# EAGLE design ospi_v14+ (EAGLE 7.1.0)
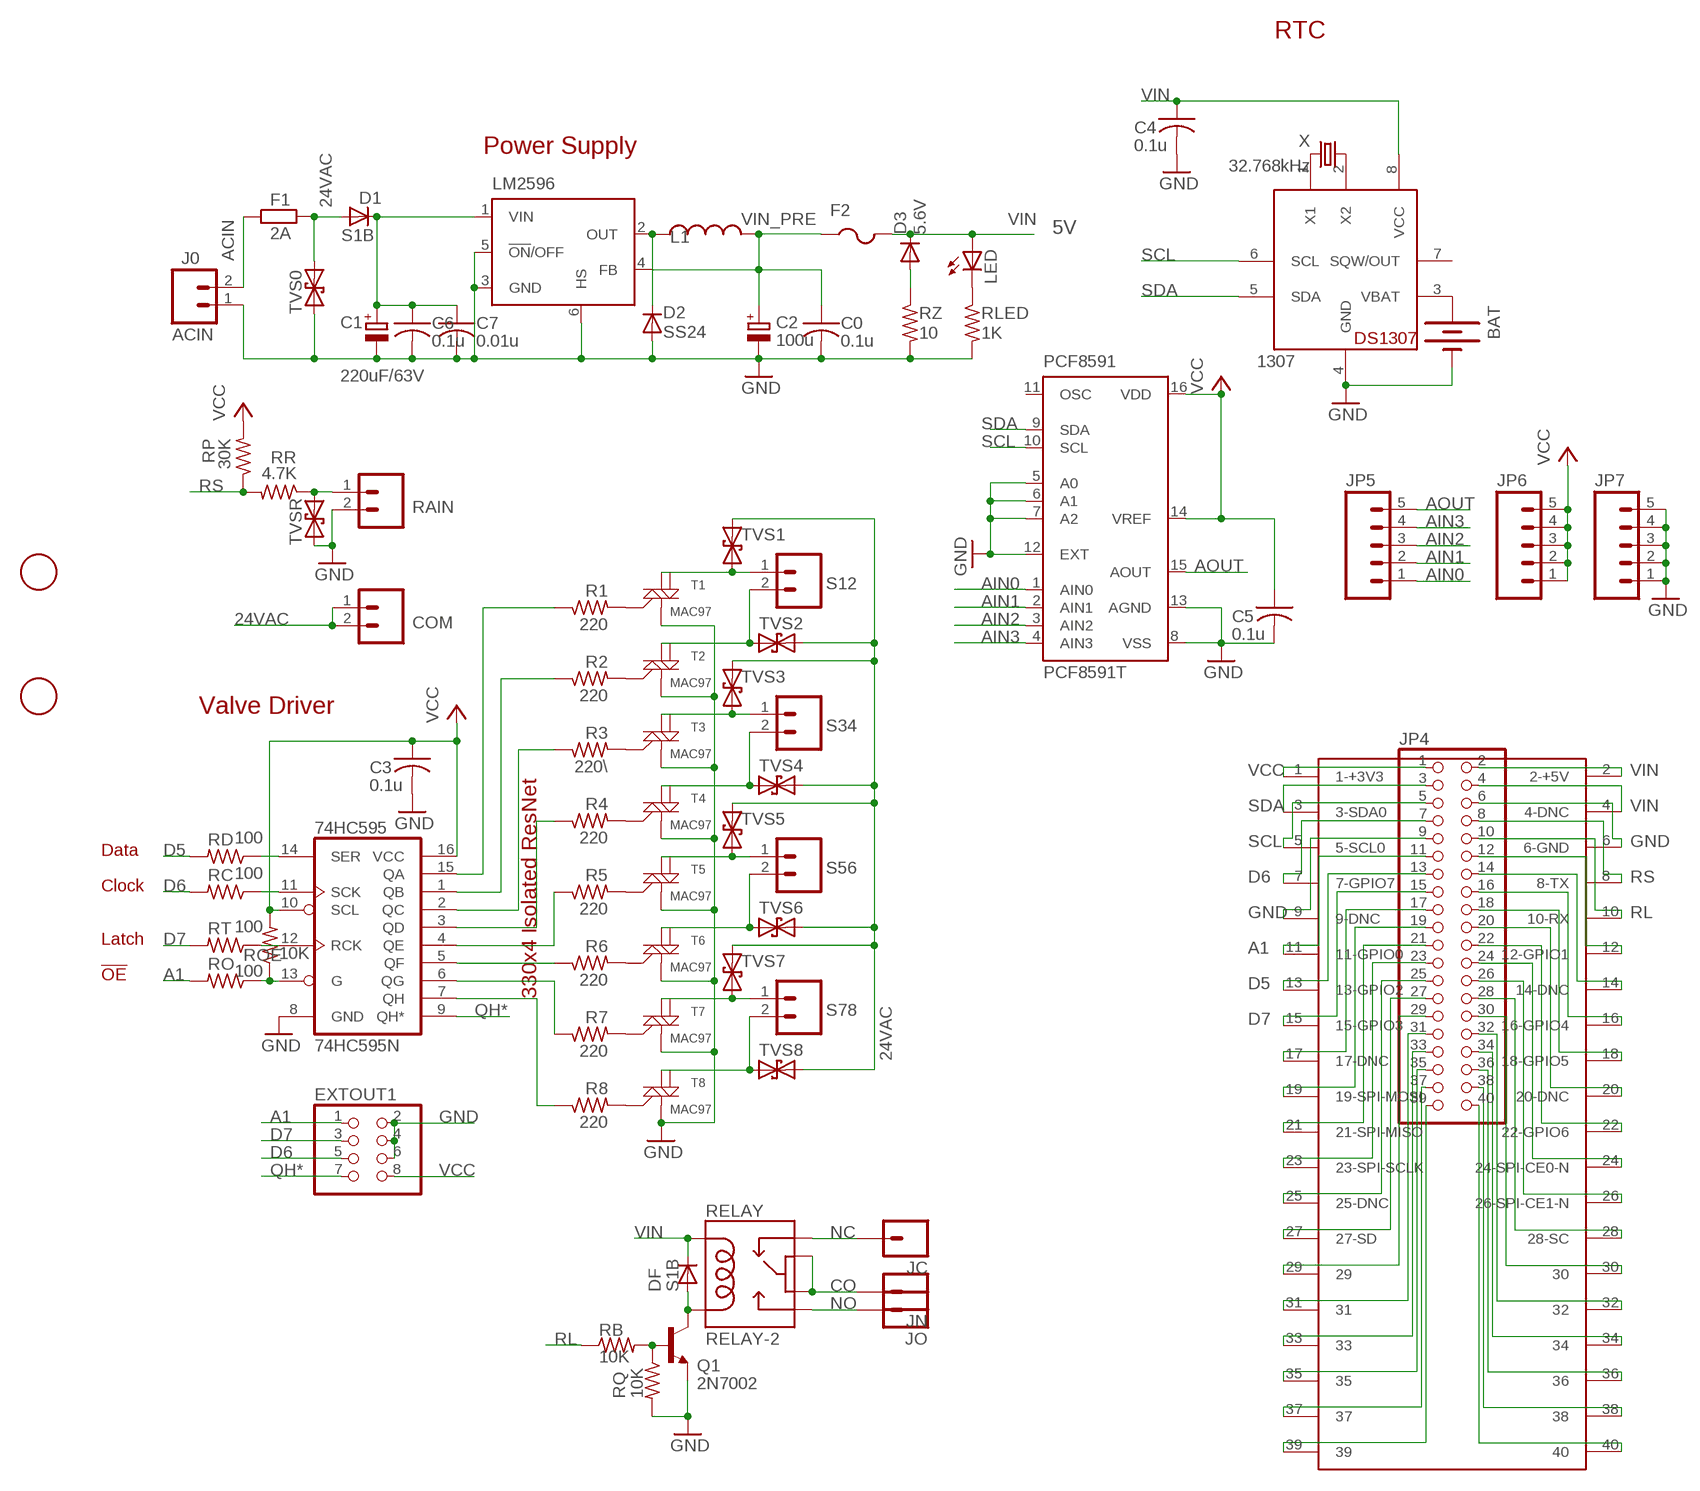
[diagram p0: schematic, sheet 1]

## Parts
74HC595  74HC595N  74LS595D  [SO16]
1307  DS1307  DS1307SOIC  [SO08]
BAT  BATTERYBATTERY_12MM_SMT  [BATTCON_12MM_SMT]
C0  0.1u  C-USC0805K  [C0805K]
C1  220uF/63V  CPOL-EUE3.5-8  [E3,5-8]
C2  100u  CPOL-EUE3.5-8  [E3,5-8]
C3  0.1u  C-USC0805K  [C0805K]
C4  0.1u  C-USC0805K  [C0805K]
C5  0.1u  C-USC0805K  [C0805K]
C6  0.1u  C-USC0805K  [C0805K]
C7  0.01u  C-USC0805K  [C0805K]
COM  M025MM-X  [SCREWTERMINAL-5MM-2-X]
D1  S1B  DIODE-DO-214AC  [DO-214AC]
D2  SS24  DIODE-SMB  [SMB]
D3  5.6V  DIODE-MINIMELF  [MINIMELF]
DF  S1B  DIODE-DO-214AC  [DO-214AC]
EXTOUT1  PINHD-2X4/90  [2X04/90]
F1  2A  R-EU_0414/5V  [0414V]
F2  PTCFUSE-1812  [1812]
J0  ACIN  M024MM-X  [SCREWTERMINAL-4MM-2-X]
JC  M01PTH  [1X01]
JN  M01PTH  [1X01]
JO  M01PTH  [1X01]
JP4  PINHD-2X20  [2X20]
JP5  M05PTH  [1X05]
JP6  M05PTH  [1X05]
JP7  M05PTH  [1X05]
L1  150uH  L-US0207/7  [0207/7]
LED  LEDCHIPLED_0805  [CHIPLED_0805]
LM2596  LM2596S  [TO263-5]
PCF8591  PCF8591T  [SO16W]
Q1  2N7002  TRANSISTOR_NPNSOT23-3  [SOT23-3]
R1  220  R-US_R0805  [R0805]
R2  220  R-US_R0805  [R0805]
R3  220\  R-US_R0805  [R0805]
R4  220  R-US_R0805  [R0805]
R5  220  R-US_R0805  [R0805]
R6  220  R-US_R0805  [R0805]
R7  220  R-US_R0805  [R0805]
R8  220  R-US_R0805  [R0805]
RAIN  M025MM-X  [SCREWTERMINAL-5MM-2-X]
RB  10K  R-US_R0805  [R0805]
RC  100  R-US_R0805  [R0805]
RD  100  R-US_R0805  [R0805]
RELAY  RELAY-2  [RELAY-HK4100F]
RLED  1K  R-US_R0805  [R0805]
RO  100  R-US_R0805  [R0805]
ROE  10K  R-US_R0805  [R0805]
RP  30K  R-US_R0805  [R0805]
RQ  10K  R-US_R0805  [R0805]
RR  4.7K  R-US_R0805  [R0805]
RT  100  R-US_R0805  [R0805]
RZ  10  R-US_R0805  [R0805]
S12  M025MM-X  [SCREWTERMINAL-5MM-2-X]
S34  M025MM-X  [SCREWTERMINAL-5MM-2-X]
S56  M025MM-X  [SCREWTERMINAL-5MM-2-X]
S78  M025MM-X  [SCREWTERMINAL-5MM-2-X]
T1  MAC97  MAC97SOT223  [SOT223]
T2  MAC97  MAC97SOT223  [SOT223]
T3  MAC97  MAC97SOT223  [SOT223]
T4  MAC97  MAC97SOT223  [SOT223]
T5  MAC97  MAC97SOT223  [SOT223]
T6  MAC97  MAC97SOT223  [SOT223]
T7  MAC97  MAC97SOT223  [SOT223]
T8  MAC97  MAC97SOT223  [SOT223]
TVS0  TVSSMB  [SMB]
TVS1  TVSSMB  [SMB]
TVS2  TVSSMB  [SMB]
TVS3  TVSSMB  [SMB]
TVS4  TVSSMB  [SMB]
TVS5  TVSSMB  [SMB]
TVS6  TVSSMB  [SMB]
TVS7  TVSSMB  [SMB]
TVS8  TVSSMB  [SMB]
TVSR  TVSSMB  [SMB]
U$1  FIDUCIAL  [FIDUCIAL_1MM]
U$2  RPIB+  [RPIB+]
U$3  FIDUCIAL  [FIDUCIAL_1MM]
X  32.768kHz  CRYSTALTC38H  [TC38H]

## Nets
24VAC [power]: COM.1 COM.2 D1.A F1.2 TVS0.C TVS1.C TVS2.C TVS3.C TVS4.C TVS5.C TVS6.C TVS7.C TVS8.C
A1: EXTOUT1.1 JP4.11 RO.2 U$2.11(11-GPIO0)
ACIN [power]: F1.1 J0.2
AIN0: JP5.1 PCF8591.1(AIN0)
AIN1: JP5.2 PCF8591.2(AIN1)
AIN2: JP5.3 PCF8591.3(AIN2)
AIN3: JP5.4 PCF8591.4(AIN3)
AOUT: JP5.5 PCF8591.15(AOUT)
CO [relay power]: JN.1 RELAY.5 RELAY.6
D5: JP4.13 RD.2 U$2.13(13-GPIO2)
D6: EXTOUT1.5 JP4.7 RC.2 U$2.7(7-GPIO7)
D7: EXTOUT1.3 JP4.15 RT.2 U$2.15(15-GPIO3)
GND [power]: 74HC595.8(GND) 1307.4(GND) BAT.P$1(-) C0.2 C1.- C2.- C3.2 C4.2 C5.2 C6.2 C7.2 D2.A EXTOUT1.2 EXTOUT1.4 EXTOUT1.6 J0.1 JP4.6 JP4.9 JP7.1 JP7.2 JP7.3 JP7.4 JP7.5 LM2596.3(GND) LM2596.5(!ON!/OFF) LM2596.6(HS) PCF8591.5(A0) PCF8591.6(A1) PCF8591.7(A2) PCF8591.8(VSS) PCF8591.12(EXT) PCF8591.13(AGND) Q1.2(E) RAIN.2 RLED.2 RQ.2 RZ.2 T1.1(M1) T2.1(M1) T3.1(M1) T4.1(M1) T5.1(M1) T6.1(M1) T7.1(M1) T8.1(M1) TVS0.A TVSR.A U$2.6(6-GND) U$2.9(9-DNC)
N$1: LED.C RLED.1
N$2 [power]: C1.+ C6.1 C7.1 D1.C LM2596.1(VIN)
N$3: R1.2 T1.3(G)
N$4: 74HC595.5(QF) R6.1
N$5: 74HC595.6(QG) R7.1
N$6: D3.A RZ.1
N$7: 74HC595.7(QH) R8.1
N$8 [power]: D2.C L1.1 LM2596.2(OUT)
N$9: 1307.1(X1) X.2
N$10: 74HC595.4(QE) R5.1
N$11: 74HC595.3(QD) R4.1
N$12: 74HC595.2(QC) R3.1
N$13: 74HC595.1(QB) R2.1
N$14: 74HC595.15(QA) R1.1
N$15: R2.2 T2.3(G)
N$16 [power]: S12.1 T1.2(M2) TVS1.A
N$17 [power]: S12.2 T2.2(M2) TVS2.A
N$18 [power]: S34.1 T3.2(M2) TVS3.A
N$19: R3.2 T3.3(G)
N$20 [power]: S34.2 T4.2(M2) TVS4.A
N$21: R4.2 T4.3(G)
N$22 [power]: S56.1 T5.2(M2) TVS5.A
N$23 [power]: S56.2 T6.2(M2) TVS6.A
N$24 [power]: S78.1 T7.2(M2) TVS7.A
N$25 [power]: S78.2 T8.2(M2) TVS8.A
N$26: R5.2 T5.3(G)
N$27: R6.2 T6.3(G)
N$28: R7.2 T7.3(G)
N$29: R8.2 T8.3(G)
N$30: 1307.2(X2) X.1
N$31: RAIN.1 RR.1 TVSR.C
N$32: Q1.1(B) RB.2 RQ.1
N$33: 74HC595.14(SER) RD.1
N$34: 74HC595.11(SCK) RC.1
N$35: 74HC595.12(RCK) RT.1
N$36: 1307.3(VBAT) BAT.P$2(+)
N$37: JP4.12 U$2.12(12-GPIO1)
N$38: JP4.14 U$2.14(14-DNC)
N$39: JP4.16 U$2.16(16-GPIO4)
N$40: 74HC595.13(G) RO.1 ROE.1
N$41: JP4.23 U$2.23(23-SPI-SCLK)
N$42: JP4.25 U$2.25(25-DNC)
N$43: JP4.27 U$2.27(27-SD)
N$44: JP4.29 U$2.29
N$45: JP4.39 U$2.39
N$46: JP4.37 U$2.37
N$47: JP4.17 U$2.17(17-DNC)
N$48: JP4.19 U$2.19(19-SPI-MOSI)
N$49: JP4.21 U$2.21(21-SPI-MISO)
N$50: JP4.35 U$2.35
N$51: JP4.33 U$2.33
N$52: JP4.31 U$2.31
N$53: JP4.34 U$2.34
N$54: JP4.36 U$2.36
N$55: JP4.38 U$2.38
N$56: JP4.40 U$2.40
N$59: JP4.18 U$2.18(18-GPIO5)
N$60: JP4.20 U$2.20(20-DNC)
N$61: JP4.22 U$2.22(22-GPIO6)
N$62: JP4.24 U$2.24(24-SPI-CE0-N)
N$63: JP4.26 U$2.26(26-SPI-CE1-N)
N$64: JP4.28 U$2.28(28-SC)
N$65: JP4.30 U$2.30
N$66: JP4.32 U$2.32
N$77 [power]: DF.A Q1.3(C) RELAY.9
NC [relay power]: JC.1 RELAY.1
NO [relay power]: JO.1 RELAY.10
QH*: 74HC595.9(QH*) EXTOUT1.7
RL: JP4.10 RB.1 U$2.10(10-RX)
RS: JP4.8 RP.1 RR.2 U$2.8(8-TX)
SCL: 1307.6(SCL) JP4.5 PCF8591.10(SCL) U$2.5(5-SCL0)
SDA: 1307.5(SDA) JP4.3 PCF8591.9(SDA) U$2.3(3-SDA0)
VCC: 74HC595.10(SCL) 74HC595.16(VCC) C3.1 C5.1 EXTOUT1.8 JP4.1 JP6.1 JP6.2 JP6.3 JP6.4 JP6.5 PCF8591.14(VREF) PCF8591.16(VDD) ROE.2 RP.2 U$2.1(1-+3V3)
VIN [power]: 1307.8(VCC) C4.1 D3.C DF.C F2.2 JP4.2 JP4.4 LED.A RELAY.2 U$2.2(2-+5V) U$2.4(4-DNC)
VIN_PRE [power]: C0.1 C2.+ F2.1 L1.2 LM2596.4(FB)
Unconnected: 1307.7(SQW/OUT) PCF8591.11(OSC) T1.4(M2-4) T2.4(M2-4) T3.4(M2-4) T4.4(M2-4) T5.4(M2-4) T6.4(M2-4) T7.4(M2-4) T8.4(M2-4)

## Notes on the sheet
- RTC
- Power Supply
- 5V
- Valve Driver
- Data
- Clock
- Latch
- !OE
- 330x4 Isolated ResNet

## Library data of the parts
74HC595 = SparkFun:74*595: 8-bit SHIFT REGISTER, output latch
1307 = adafruit:DS1307: DS1307 Real time clock (RTC) with battery backup ability. Talk to it via i2c
BAT = SparkFunNew:BATTERY: Battery Holders Various common sizes : AA, AAA, 20mm coin cell and 12mm coin cell.
C0 C3-C7 = adafruit:C-US: CAPACITOR, American symbol
C1 C2 = resistor:CPOL-EU: POLARIZED CAPACITOR, European symbol
COM J0 RAIN S12 S34 S56 S78 = SparkFun:M02: Header 2 Standard 2-pin 0.1" header. Use with straight break away headers (SKU : PRT-00116), right angle break away headers (PRT-00553), swiss pins (PRT-00743), machine pins (PRT-00117), and female headers (PRT-00115). Molex polarized connector foot print use with SKU : PRT-08233 with associated crimp pins and housings.
D1-D3 DF = diode:DIODE-: DIODE
EXTOUT1 = pinhead:PINHD-2X4: PIN HEADER
F1 = rcl:R-EU_: RESISTOR, European symbol
F2 = adafruit:PTCFUSE: PTC fuses, resettable thermistors
JC JN JO = SparkFun:M01: Header 1 Standard 1-pin 0.1" header. Use with straight break away headers (SKU : PRT-00116), right angle break away headers (PRT-00553), swiss pins (PRT-00743), machine pins (PRT-00117), and female headers (PRT-00115).
JP4 = adafruit_3:PINHD-2X20: PIN HEADER
JP5-JP7 = SparkFun:M05: Header 5 Standard 5-pin 0.1" header. Use with straight break away headers (SKU : PRT-00116), right angle break away headers (PRT-00553), swiss pins (PRT-00743), machine pins (PRT-00117), and female headers (PRT-00115). Molex polarized connector foot print use with SKU : PRT-08230 with associated crimp pins and housings.
L1 = rcl:L-US: INDUCTOR, American symbol
LED = adafruit:LED: LED OSRAM: - CHIPLED LG R971, LG N971, LY N971, LG Q971, LY Q971, LO R971, LY R971 LH N974, LH R974 LS Q976, LO Q976, LY Q976 LO Q996 - Hyper CHIPLED LW Q18S LB Q993, LB Q99A, LB R99A - SideLED LS A670, LO A670, LY A670, LG A670, LP A670 LB A673, LV A673, LT A673, LW A673 LH A674 LY A675 LS A676, LA A676, LO A676, LY A676, LW A676 LS A679, LY A679, LG A679 - Hyper Micro SIDELED® LS Y876, LA Y876, LO Y876, LY Y876 LT Y87S - SmartLED LW L88C, LW L88S LB L89C, LB L89S, LG L890 LS L89K, LO L89K, LY L89K LS L896, LA L896, LO L896, LY L896 - TOPLED LS T670, LO T670, LY T670, LG T670, LP T670 LSG T670, LSP T670, LSY T670, LOP T670, LYG T670 LG T671, LOG T671, LSG T671 LB T673, LV T673, LT T673, LW T673 LH T674 LS T676, LA T676, LO T676, LY T676, LB T676, LH T676, LSB T676, LW T676 LB T67C, LV T67C, LT T67C, LS T67K, LO T67K, LY T67K, LW E67C LS E67B, LA E67B, LO E67B, LY E67B, LB E67C, LV E67C, LT E67C LW T67C LS T679, LY T679, LG T679 LS T770, LO T770, LY T770, LG T770, LP T770 LB T773, LV T773, LT T773, LW T773 LH T774 LS E675, LA E675, LY E675, LS T675 LS T776, LA T776, LO T776, LY T776, LB T776 LHGB T686 LT T68C, LB T68C - Hyper Mini TOPLED® LB M676 - Mini TOPLED Santana® LG M470 LS M47K, LO M47K, LY M47K Source: http://www.osram.convergy.de/
LM2596 = national-semiconductor:LM2596: SIMPLE SWITCHER® Power Converter 150 kHz 3A Step-Down Voltage Regulator Source: http://www.national.com/ds/LM/LM2596.pdf; MF: NATIONAL SEMICONDUCTOR; MPN: LM2596S-ADJ/NOPB; OC_FARNELL: 9494367; OC_NEWARK: 41K3842
PCF8591 = micro-philips:PCF8591: I2C-Bus D/A CONVERTER; MPN: PCF8591T/2,512; OC_FARNELL: 1826767; OC_NEWARK: 70R6911
Q1 = SparkFunNew:TRANSISTOR_NPN: Transistor NPN BJT configuration in SOT23 package. MMBT2222 is the common NPN we use. Double check BCE configuration again layout.
R1-R8 RB RC RD RLED RO ROE RP RQ RR RT RZ = adafruit2013:R-US_: RESISTOR, American symbol
RELAY = SparkFunNew:RELAY-2
T1-T8 = SparkFun:MAC97: MAC97 Triac http://www.onsemi.com/pub_link/Collateral/MAC97-D.PDF
TVS0 TVS1-TVS8 TVSR = SparkFunNew:TVS
U$1 U$3 = adafruitGood:FIDUCIAL: For use by pick and place machines to calibrate the vision/machine, 1mm By microbuilder.eu
U$2 = RaspberryPi:RPIB+
X = crystal:CRYSTAL: CRYSTAL; OC_FARNELL: unknown; OC_NEWARK: unknown

## Net classes
0 default: width 0.178 mm, clearance 0.178 mm
1 power: width 0.406 mm, clearance 0.254 mm
2 relay power: width 0.508 mm, clearance 0.305 mm

## Board
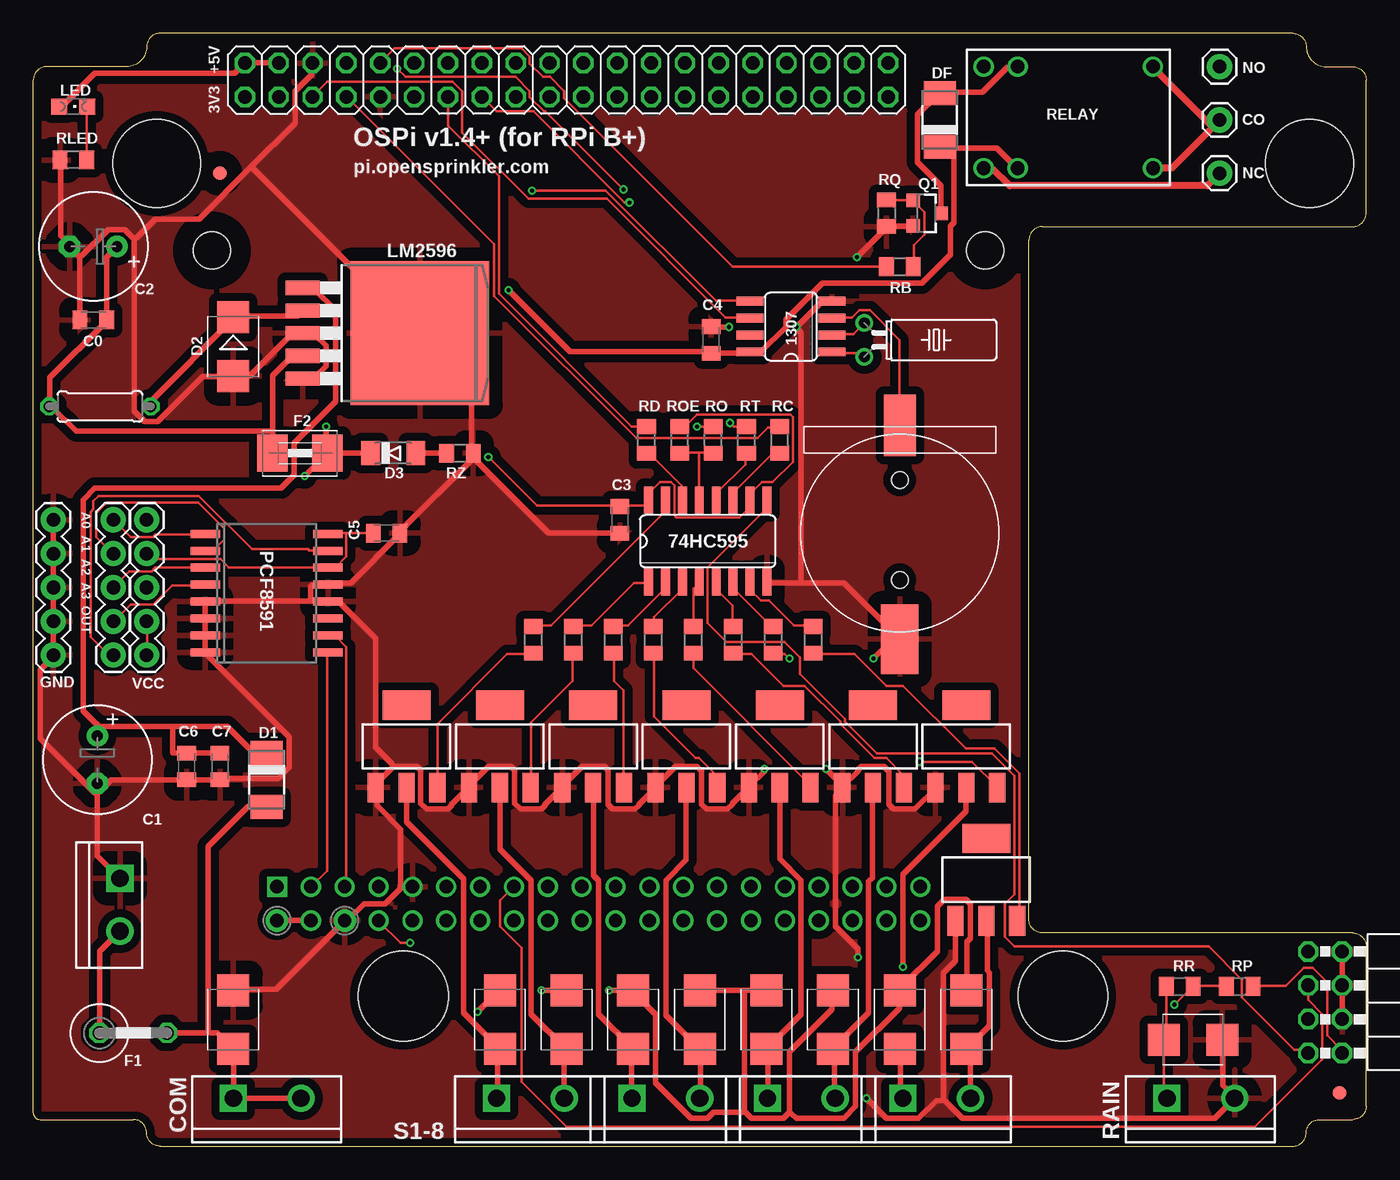
[diagram p1: board, top side]
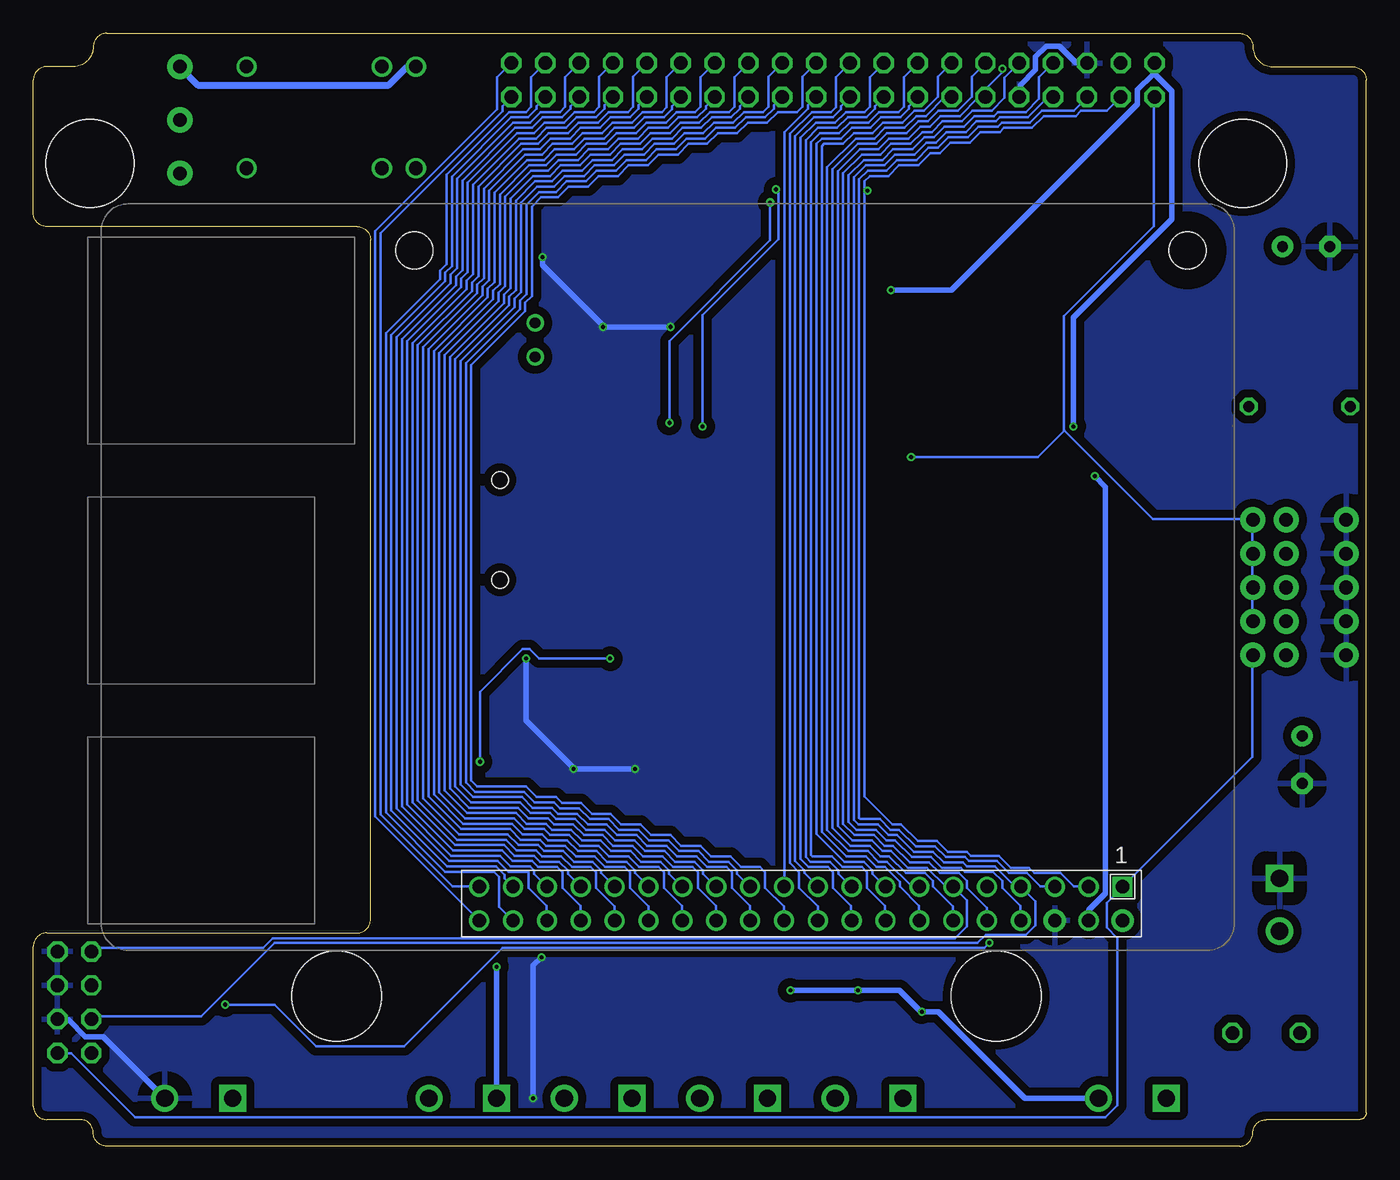
[diagram p2: board, bottom side, seen from below]

Size 100 x 83.5 mm. Coordinates in mm from the lower left corner, seen from the top.
Outline: 9.5,0 94.5,0 arc90 95.5,1 arc-90 96.5,2 99,2 arc90 100,3 100,15 arc90 99,16 75.7,16 arc-90 74.7,17 74.7,68 arc-90 75.7,69 99,69 arc90 100,70 100,80 arc90 99,81 97,81 arc-90 95.5,82.5 arc90 94.5,83.5 9.5,83.5 arc90 8.5,82.5 arc-90 7,81 1,81 arc90 0,80 0,2.5 arc90 0.5,2 7.5,2 arc-90 8.5,1 arc90 9.5,0
Copper layers (1*16): Top 0.035mm / dielectric 1.5mm / Bottom 0.035mm
Design rules "Fusion_eagle_rule_v1.1 *": minimum track width 6mil, minimum drill 12mil, track to track 6mil, track to pad 6mil, pad to pad 6mil, via to via 6mil, smd to smd 0mil, copper to edge 10mil, drill to drill 10mil, minimum pad ring 10mil, minimum via ring 6mil, stop-mask expansion 2mil, vias tented up to drill 100mil, thermal gap 40mil
Holes 6.6 mm at 9.26,73.74 95.74,73.74
Holes 6.75 mm at 27.76,11.26 77.24,11.26
tRestrict: area 69.1,64.9 to 73.7,69.5; area 11.1,64.9 to 15.7,69.5
bRestrict: area 11.1,64.9 to 15.7,69.5; area 69.1,64.9 to 73.7,69.5

### Footprints (pad centres in the part's own frame; a part is rotated, then mirrored left to right if it is on the bottom)
SO16 = smd 0.66 x 2.032: 1 -4.445,-3.073; 2 -3.175,-3.073; 3 -1.905,-3.073; 4 -0.635,-3.073; 5 0.635,-3.073; 6 1.905,-3.073; 7 3.175,-3.073; 8 4.445,-3.073; 9 4.445,3.073; 10 3.175,3.073; 11 1.905,3.073; 12 0.635,3.073; 13 -0.635,3.073; 14 -1.905,3.073; 15 -3.175,3.073; 16 -4.445,3.073
SO08 = smd 0.66 x 2.032: 1 -1.905,-3.073; 2 -0.635,-3.073; 3 0.635,-3.073; 4 1.905,-3.073; 5 1.905,3.073; 6 0.635,3.073; 7 -0.635,3.073; 8 -1.905,3.073
BATTCON_12MM_SMT = smd 2.8 x 5.2: P$1 0,11.96 | smd 2.4 x 4.6: P$2 0,-4.1 | hole 1.25: 0,7.5; 0,0
C0805K = smd 1.1 x 1.4: 1 -1,0; 2 1,0
E3,5-8 = drill 0.813 pad 1.6: + -1.778,0 | drill 0.813 pad 1.6 octagon: - 1.778,0
SCREWTERMINAL-5MM-2-X = drill 1.3 pad 2.032 square: 1 0,0 | drill 1.3 pad 2.032: 2 5.08,0
DO-214AC = smd 1.8 x 2.4: A 2.025,0; C -2.025,0
SMB = smd 2.4 x 2.4: A 2.2,0; C -2.2,0
MINIMELF = smd 1.4 x 1.8: A 1.7,0; C -1.7,0
2X04/90 = drill 1.016 octagon: 1 -3.81,-6.35; 2 -3.81,-3.81; 3 -1.27,-6.35; 4 -1.27,-3.81; 5 1.27,-6.35; 6 1.27,-3.81; 7 3.81,-6.35; 8 3.81,-3.81
0414V = drill 1.016 octagon: 1 -2.54,0; 2 2.54,0
1812 = smd 2.286 x 2.794: 1 -2.046,0; 2 2.046,0
SCREWTERMINAL-4MM-2-X = drill 1.3 pad 2.032 square: 1 0,0 | drill 1.3 pad 2.032: 2 3.96,0
1X01 = drill 1.016 pad 1.88: 1 0,0
2X20 = drill 1.016 octagon: 1 -24.13,-1.27; 2 -24.13,1.27; 3 -21.59,-1.27; 4 -21.59,1.27; 5 -19.05,-1.27; 6 -19.05,1.27; 7 -16.51,-1.27; 8 -16.51,1.27; 9 -13.97,-1.27; 10 -13.97,1.27; 11 -11.43,-1.27; 12 -11.43,1.27; 13 -8.89,-1.27; 14 -8.89,1.27; 15 -6.35,-1.27; 16 -6.35,1.27; 17 -3.81,-1.27; 18 -3.81,1.27; 19 -1.27,-1.27; 20 -1.27,1.27; 21 1.27,-1.27; 22 1.27,1.27; 23 3.81,-1.27; 24 3.81,1.27; 25 6.35,-1.27; 26 6.35,1.27; 27 8.89,-1.27; 28 8.89,1.27; 29 11.43,-1.27; 30 11.43,1.27; 31 13.97,-1.27; 32 13.97,1.27; 33 16.51,-1.27; 34 16.51,1.27; 35 19.05,-1.27; 36 19.05,1.27; 37 21.59,-1.27; 38 21.59,1.27; 39 24.13,-1.27; 40 24.13,1.27
1X05 = drill 1.016 pad 1.88: 1 0,0; 2 2.54,0; 3 5.08,0; 4 7.62,0; 5 10.16,0
0207/7 = drill 0.813 octagon: 1 -3.81,0; 2 3.81,0
CHIPLED_0805 = smd 1.2 x 1.2: A 0,-1.05; C 0,1.05
TO263-5 = smd 1.067 x 2.54: 1 -3.404,-5.791; 2 -1.702,-5.791; 3 0,-5.791; 4 1.702,-5.791; 5 3.404,-5.791 | smd 10.8 x 10.41: 6 0,3
SO16W = smd 0.6 x 2.2: 1 -4.445,-4.6; 2 -3.175,-4.6; 3 -1.905,-4.6; 4 -0.635,-4.6; 5 0.635,-4.6; 6 1.905,-4.6; 7 3.175,-4.6; 8 4.445,-4.6; 9 4.445,4.6; 10 3.175,4.6; 11 1.905,4.6; 12 0.635,4.6; 13 -0.635,4.6; 14 -1.905,4.6; 15 -3.175,4.6; 16 -4.445,4.6
SOT23-3 = smd 1 x 1: 1 -0.95,-1; 2 0.95,-1; 3 0,1.1
R0805 = smd 1.1 x 1.4: 1 -1,0; 2 1,0
RELAY-HK4100F = drill 1.016: 1 12.7,7.62; 2 10.16,7.62; 5 0,7.62; 6 0,0; 9 10.16,0; 10 12.7,0
SOT223 = smd 1.219 x 2.235: 1 -2.311,-3.099; 2 0,-3.099; 3 2.311,-3.099 | smd 3.6 x 2.2: 4 0,3.099
FIDUCIAL_1MM = smd 1 x 1: 1 0,0
RPIB+ = drill 1 square: 1 8.382,51.232 | drill 1 pad 1.676: 2 8.382,53.772; 6 13.462,53.772 | drill 1: 3 10.922,51.232; 4 10.922,53.772; 5 13.462,51.232; 7 16.002,51.232; 8 16.002,53.772; 9 18.542,51.232; 10 18.542,53.772; 11 21.082,51.232; 12 21.082,53.772; 13 23.622,51.232; 14 23.622,53.772; 15 26.162,51.232; 16 26.162,53.772; 17 28.702,51.232; 18 28.702,53.772; 19 31.242,51.232; 20 31.242,53.772; 21 33.782,51.232; 22 33.782,53.772; 23 36.322,51.232; 24 36.322,53.772; 25 38.862,51.232; 26 38.862,53.772; 27 41.402,51.232; 28 41.402,53.772; 29 43.942,51.232; 30 43.942,53.772; 31 46.482,51.232; 32 46.482,53.772; 33 49.022,51.232; 34 49.022,53.772; 35 51.562,51.232; 36 51.562,53.772; 37 54.102,51.232; 38 54.102,53.772; 39 56.642,51.232; 40 56.642,53.772 | hole 2.8: 3.5,3.5; 61.5,3.5
TC38H = drill 0.813: 1 -1.27,0; 2 1.27,0

### Placement (x,y rotation side)
74HC595  50.6,45.4 0 top
1307  56.85,61.5 90 top
BAT  65,50 180 top
C0  4.5,62 180 top
C1  4.8,29 270 top
C2  4.5,67.5 180 top
C3  44,47 270 top
C4  50.85,60.5 90 top
C5  26.5,46 0 top
C6  11.5,28.5 270 top
C7  14,28.5 270 top
COM  15,3.6 0 top
D1  17.5,27.5 270 top
D2  15,60 270 top
D3  27,52 0 top
DF  68,77 90 top
EXTOUT1  102,10.8 270 top
F1  7.5,8.5 0 top
F2  20,52 0 top
J0  6.5,20.1 270 top
JC  89,73 0 top
JN  89,77 0 top
JO  89,81 0 top
JP4  40,80 0 top
JP5  6,47 270 top
JP6  8.5,47 270 top
JP7  1.5,47 270 top
L1  5,55.5 180 top
LED  3,78 270 top
LM2596  26,61 270 top
PCF8591  17.5,41.5 270 top
Q1  67,70 270 top
R1  37.5,38 270 top
R2  40.5,38 270 top
R3  43.5,38 270 top
R4  46.5,38 270 top
R5  49.5,38 270 top
R6  52.5,38 270 top
R7  55.5,38 270 top
R8  58.5,38 270 top
RAIN  85.05,3.6 0 top
RB  65,66 0 top
RC  56,53 90 top
RD  46,53 90 top
RELAY  84,81 180 top
RLED  3,74 180 top
RO  51,53 90 top
ROE  48.5,53 90 top
RP  90.5,12 0 top
RQ  64,70 270 top
RR  86,12 0 top
RT  53.5,53 90 top
RZ  32,52 0 top
S12  34.76,3.6 0 top
S34  44.92,3.6 0 top
S56  55.08,3.6 0 top
S78  65.24,3.6 0 top
T1  28,30 0 top
T2  35,30 0 top
T3  42,30 0 top
T4  49,30 0 top
T5  56,30 0 top
T6  63,30 0 top
T7  70,30 0 top
T8  71.5,20 0 top
TVS0  15,9.5 90 top
TVS1  35,9.5 270 top
TVS2  40,9.5 270 top
TVS3  45,9.5 270 top
TVS4  50,9.5 270 top
TVS5  55,9.5 270 top
TVS6  60,9.5 270 top
TVS7  65,9.5 270 top
TVS8  70,9.5 270 top
TVSR  87,8 0 top
U$1  14,73 0 top
U$2  9.9,70.7 180 bottom
U$3  98,4 0 top
X  62.35,60.5 270 top

### Tracks (layer width: path | path; a pad name or v marks a point on that pad's centre or on a via)
24VAC  (via drill 0.3)
  Top 0.406: 53.34,11.69 54.94,11.69 TVS5.C | 53.34,11.69 50.05,11.69 TVS4.C | 56.72,2.53 56.72,7.07 59.92,10.27 59.92,11.69 TVS6.C | 56.72,2.53 56.27,2.09 53.87,2.09 53.34,2.62 | 53.34,11.69 53.34,2.62 | 56.72,2.53 56.9,2.44 57.25,2.09 60.81,2.09 61.7,2.98 61.7,7.07 64.99,10.36 64.99,11.69 TVS7.C 65.08,11.87 67.83,14.62 67.83,18 68.36,18.54 69.96,18.54 70.32,18.18 70.32,15.6 70.05,15.34 70.05,11.78 TVS8.C | v33.34,10.09 34.94,11.69 TVS1.C | v38.14,11.69 39.92,11.69 TVS2.C | v43.2,11.69 44.98,11.69 TVS3.C 45.07,11.51 46.67,9.91 46.67,4.76 49.34,2.09 50.58,2.09 51.03,2.53 53.16,2.53 53.34,2.62 | COM.2 20,3.6 15.2,3.6 COM.1 15.02,3.6 15.02,7.25 TVS0.C 14.85,7.42 13.78,8.49 13.1,8.49 | 13.1,8.49 F1.2 | 13.1,8.49 13.1,22.5 16.1,25.5 17.5,25.5 D1.A
  Bottom 0.406: COM.2 20.09,3.6 25.6,3.6 32.09,10.09 v33.34,10.09 33.52,10.18 35.03,11.69 v38.14,11.69 v43.2,11.69
A1  (via drill 0.3)
  Top 0.178: v49.78,54.01 50.94,54.01 RO.2 | v44.27,71.79 38.41,77.65 38.32,77.65 37.25,78.72 37.25,79.17 36.18,80.23 27.91,80.23 v27.29,80.85
  Bottom 0.178: v49.78,54.01 49.78,62.36 44.09,68.05 44.09,71.61 v44.27,71.79 | v27.29,80.85 27.29,80.59 28.54,79.34 28.54,78.81 JP4.11 28.6,78.7 29.1,78.7 30.5,77.3 31.95,77.3 32.75,76.5 33.45,76.5 34.35,75.6 35.8,75.6 36.6,74.8 38,74.8 39.65,73.15 39.65,24.05 38.55,22.95 37.1,22.95 36.3,22.15 35.65,22.15 34.4,20.9 32.95,20.9 31.55,19.5 31,19.5 U$2.11 30.94,19.42 29.96,18.45 29.96,16.49 30.85,15.6 82.06,15.6 82.77,14.89 95.57,14.89 EXTOUT1.1
ACIN
  Top 0.406: F1.1 4.98,8.58 4.98,14.62 J0.2
AIN0
  Top 0.178: PCF8591.1 12.89,45.89 9.16,45.89 8.98,45.72 7.29,45.72 6.04,46.96 JP5.1
AIN1
  Top 0.178: PCF8591.2 12.98,44.74 13.51,44.74 14.31,45.54 14.31,46.34 12.36,48.29 5.51,48.29 4.71,47.49 4.71,45.72 5.96,44.47 JP5.2
AIN2
  Top 0.178: PCF8591.3 9.16,43.4 8.89,43.14 7.2,43.14 6.04,41.98 JP5.3
AIN3
  Top 0.178: PCF8591.4 12.89,42.07 10.4,42.07 8.98,40.65 7.29,40.65 6.04,39.4 JP5.4
AOUT
  Top 0.178: PCF8591.15 22.1,44.7 20.7,44.7 20.6,44.8 16.4,44.8 12.4,48.8 4.9,48.8 4.5,48.4 4.5,47.8 4.3,47.6 4.3,38.2 5.6,36.9 6,36.9 JP5.5
CO
  Top 0.508: RELAY.5 85.43,73.39 88.99,76.94 JN.1 88.37,76.59 84.01,80.94 RELAY.6
D5
  Top 0.178: RD.2 45.96,54.01 44.9,54.01 34.94,63.96 34.94,72.76 31.11,76.59 JP4.13
  Bottom 0.178: U$2.13 33.55,19.5 34.1,19.5 35.95,21.35 36.6,21.35 37.4,22.15 38.85,22.15 40.45,23.75 40.45,73.45 38.3,75.6 36.9,75.6 36.1,76.4 34.65,76.4 33.75,77.3 33.05,77.3 31.65,78.7 31.15,78.7 JP4.13
D6
  Top 0.178: RC.2 55.92,53.92 55.12,53.92 54.32,53.12 45.25,53.12 34.58,63.78 34.58,67.7 23.56,78.72 JP4.7
  Bottom 0.178: JP4.7 23.5,78.7 23.9,78.7 25.4,77.2 27.5,77.2 27.8,76.9 29.25,76.9 30.05,76.1 31.5,76.1 32.3,75.3 33,75.3 33.9,74.4 35.35,74.4 36.15,73.6 37.55,73.6 38.45,72.7 38.45,24.5 38.1,24.15 36.65,24.15 35.85,23.35 35.2,23.35 33.95,22.1 32.5,22.1 31.7,21.3 30.25,21.3 29.95,21 27.85,21 26.35,19.5 25.95,19.5 U$2.7 25.87,19.42 24.8,18.36 24.8,16.58 25.51,15.87 28.54,15.87 29.16,15.25 81.88,15.25 87.39,9.73 95.57,9.73 EXTOUT1.5
D7  (via drill 0.3)
  Top 0.178: v52.27,54.27 52.54,54.01 53.43,54.01 RT.2 | v44.72,70.81 44.36,70.81 37.52,77.65 34.76,77.65 33.69,78.72 JP4.15 | EXTOUT1.3 95.66,12.05 95.66,10.98 96.72,9.91 96.72,6.53 91.66,1.47 40.01,1.47 36.63,4.85 36.63,14.89 35.03,16.49 35.03,18.45 36.01,19.42 U$2.15
  Bottom 0.178: U$2.15 36.1,19.5 37.05,20.45 37.05,20.7 37.7,21.35 39.15,21.35 41.25,23.45 41.25,75.2 40.85,75.6 39.4,75.6 38.6,76.4 37.2,76.4 36.4,77.2 34.95,77.2 34.3,77.85 34.3,78.05 33.65,78.7 JP4.15 | v52.27,54.27 52.27,60.41 44.72,67.96 v44.72,70.81
GND  (via drill 0.3)
  Top 0.406: LM2596.5 20.27,57.65 21.07,57.65 21.96,58.54 21.96,60.05 21.16,60.85 20.36,60.85 LM2596.3 20.18,60.94 19.38,60.94 16.27,57.83 15.02,57.83 D2.A 14.85,57.74 12.71,57.74 9.34,54.36 8.36,54.36 7.56,55.16 7.56,68.05 | 3.47,66.72 3.47,62.01 C0.2 | 3.47,66.72 2.76,67.43 C2.- 2.67,67.7 2.04,68.32 2.04,73.92 RLED.2 | 7.56,68.05 6.84,68.76 5.6,68.76 3.65,66.81 3.47,66.72 | 16.36,73.48 12.45,69.56 9.16,69.56 7.73,68.14 7.56,68.05 | 16.36,73.48 19.65,76.77 19.65,79.17 20.89,80.41 20.89,81.21 JP4.6 | 16.36,73.48 28.8,61.03 LM2596.6 29.07,60.85 32.89,57.03 32.89,52.14 RZ.2 | 57.61,42.27 60.81,42.27 64.99,38.09 BAT.P$1 64.63,38.18 v63.03,36.58 | 57.61,42.27 55.12,42.27 74HC595.8 | Q1.2 65.96,69.03 64.01,69.03 RQ.2 63.92,68.85 v61.78,66.72 | v52.18,61.47 50.85,61.47 C4.2 | 1307.4 59.92,63.34 59.12,63.34 v57.25,61.47 57.34,61.3 57.61,61.03 57.61,42.27 | 68.28,3.51 68.28,13.02 69.16,13.91 69.16,16.85 T8.1 | 68.28,3.51 69.7,2.09 88.63,2.09 90.06,3.51 RAIN.2 90.06,3.78 89.26,4.58 89.26,7.96 TVSR.A | JP7.1 1.51,46.96 1.51,44.65 JP7.2 1.51,44.38 1.51,42.07 JP7.3 1.51,41.89 1.51,39.58 JP7.4 1.51,39.31 1.51,36.91 JP7.5 1.4,36.65 0.5,35.75 0.5,30.6 4.6,26.5 C1.- | TVS0.A 15.02,11.78 18.22,11.78 23.29,16.85 U$2.6 23.56,16.94 24.8,18.18 26.4,18.18 27.65,19.42 | 27.65,19.42 28.36,19.42 U$2.9 | T6.1 60.72,26.98 61.87,28.14 61.87,28.23 62.14,28.49 63.83,28.49 64.19,28.14 64.19,25.65 64.54,25.29 66.14,25.29 67.74,26.89 T7.1 | 27.03,28.49 28.8,28.49 29.07,28.23 29.07,25.74 29.52,25.29 31.11,25.29 31.38,25.56 31.38,25.65 32.63,26.89 T2.1 32.72,27.07 34.14,28.49 35.83,28.49 36.09,28.23 36.09,25.74 36.54,25.29 38.14,25.29 38.41,25.56 38.41,25.65 39.65,26.89 T3.1 39.74,27.07 41.16,28.49 42.85,28.49 43.12,28.23 43.12,25.65 43.47,25.29 45.16,25.29 45.43,25.56 45.43,25.65 46.67,26.89 T4.1 46.76,27.07 48.18,28.49 49.78,28.49 50.14,28.14 50.14,25.65 50.49,25.29 52.09,25.29 52.45,25.65 52.45,25.74 53.61,26.89 T5.1 53.78,27.07 54.85,28.14 v54.85,28.31
  Top 0.406: 27.03,28.49 25.78,27.25 T1.1 25.78,26.71 25.78,25.56 27.56,23.78 27.56,19.6 27.65,19.42 | v59.47,28.31 60.63,27.16 T6.1 | v62.5,3.6 64.01,2.09 66.41,2.09 67.74,3.42 68.1,3.42 68.28,3.51 | v61.87,14.18 61.87,14.8 60.19,16.49 60.19,26.27 60.63,26.71 T6.1 | C1.- 4.8,21.8 J0.1 | C1.- 4.95,26.6 5.85,27.5 C6.2 C7.2 14.13,27.6 18.4,27.6 19.2,28.4 19.2,30.71 12.98,36.94 PCF8591.8 12.89,37.09 12.89,38.25 PCF8591.7 12.89,38.51 PCF8591.6 12.89,39.76 12.89,40.83 PCF8591.5 13.1,40.9 20.7,40.9 20.8,41 | 20.8,41 20.9,40.9 22.1,40.9 PCF8591.12 22.23,40.76 23.02,40.76 25.69,38.09 25.69,29.91 26.94,28.67 27.03,28.49 | 20.8,41 20.8,42 20.9,42.1 22.1,42.1 PCF8591.13 22.23,42.27 23.82,42.27 27.47,45.92 C5.2 27.56,46.18 32.98,51.61 32.98,51.96 RZ.2 | C3.2 43.92,46.01 38.67,46.01 33.16,51.52 RZ.2 | EXTOUT1.2 EXTOUT1.4 EXTOUT1.6
  Bottom 0.406: JP4.6 20.98,81.3 21.78,81.3 23.02,82.54 24,82.54 24.8,81.74 24.8,80.77 25.96,79.61 25.96,78.81 JP4.9 | v52.18,61.47 v57.25,61.47 57.34,61.65 61.78,66.1 v61.78,66.72 | v54.85,28.31 v59.47,28.31 59.56,28.49 63.03,31.96 v63.03,36.58 | v62.5,3.6 62.5,13.56 v61.87,14.18 | EXTOUT1.6 98.15,9.47 97.35,9.47 96.1,8.22 94.77,8.22 90.14,3.6 RAIN.2
  pour Top (isolate 0.61): 0,84 100,84 100,0 0,0
  pour Bottom (isolate 0.61): 0,84 100,84 100,0 0,0
N$1
  Top 0.178: LED.C 4,77.92 RLED.1
N$2
  Top 0.406: 10.45,31.5 14.55,31.5 16.5,29.55 17.5,29.55 D1.C | 10.45,31.5 4.8,31.5 | 10.45,31.5 10.45,29.55 10.5,29.5 C6.1 C7.1 | LM2596.1 20.27,64.32 21.07,64.32 22.67,62.72 22.67,55.87 19.56,52.76 19.56,50.36 18.58,49.38 4.62,49.38 3.73,48.49 3.73,32.67 4.71,31.69 4.8,31.69 4.8,31.5 | 4.8,31.5 C1.+
N$3
  Top 0.178: R1.2 37.43,36.94 35.56,36.94 30.32,31.69 30.32,26.98 T1.3
N$4
  Top 0.178: R6.1 52.45,39.07 52.45,40.58 51.3,41.74 51.3,42.27 74HC595.5
N$5
  Top 0.178: R7.1 55.47,39.07 55.3,39.07 52.54,41.83 52.54,42.27 74HC595.6
N$6
  Top 0.406: D3.A RZ.1
N$7
  Top 0.178: R8.1 58.5,39.07 57.07,39.07 55.21,40.94 54.59,40.94 53.78,41.74 53.78,42.27 74HC595.7
N$8
  Top 0.406: LM2596.2 20.18,62.63 19.82,62.27 15.02,62.27 D2.C 14.94,62.01 8.89,55.96 8.89,55.52 L1.1
N$9
  Top 0.178: 1307.1 60.01,59.52 62.05,59.52 62.32,59.25 X.2
N$10
  Top 0.178: R5.1 49.52,39.07 49.52,41.83 49.96,42.27 74HC595.4
N$11
  Top 0.178: R4.1 46.58,39.07 46.58,39.69 48.63,41.74 48.63,42.27 74HC595.3
N$12
  Top 0.178: R3.1 43.56,39.07 44.63,39.07 47.38,41.83 47.38,42.27 74HC595.2
N$13
  Top 0.178: R2.1 40.54,39.07 41.87,39.07 45.07,42.27 46.14,42.27 74HC595.1
N$14
  Top 0.178: R1.1 37.52,39.07 38.85,39.07 47.38,47.61 47.38,48.41 74HC595.15
N$15
  Top 0.178: R2.2 40.45,36.94 40.45,34.89 37.34,31.78 37.34,26.98 T2.3
N$16
  Top 0.406: T1.2 28,24.31 32.27,20.05 32.27,10 34.94,7.33 TVS1.A 34.85,7.16 34.85,3.6 S12.1
N$17
  Top 0.406: T2.2 35.03,26.89 35.03,22.27 37.34,19.96 37.34,9.91 39.92,7.33 TVS2.A 39.83,7.16 39.83,3.6 S12.2
N$18
  Top 0.406: T3.2 42.05,26.89 42.05,20.31 42.41,19.96 42.41,9.91 44.98,7.33 TVS3.A 44.9,7.16 44.9,3.6 S34.1
N$19
  Top 0.178: R3.2 43.56,36.94 43.56,34.89 44.27,34.18 44.27,26.98 T3.3
N$20
  Top 0.406: T4.2 48.98,26.89 48.98,21.47 47.47,19.96 47.47,9.82 49.96,7.33 TVS4.A 50.05,7.16 50.05,3.6 S34.2
N$21
  Top 0.178: R4.2 46.58,36.94 46.58,32.23 49.7,29.11 49.96,29.11 51.3,27.78 51.3,26.98 T4.3
N$22
  Top 0.406: T5.2 56.01,21.56 57.61,19.96 57.61,9.91 55.03,7.33 TVS5.A 55.12,7.16 55.12,3.6 S56.1
N$23
  Top 0.406: T6.2 62.94,26.89 62.94,20.14 62.67,19.87 62.67,10 60.01,7.33 TVS6.A 60.1,7.16 60.1,3.6 S56.2
N$24  (via drill 0.3)
  Top 0.406: v65.25,13.47 65.25,20.4 69.96,25.11 69.96,26.89 T7.2 | TVS7.A 65.08,7.25 65.08,3.69 65.16,3.6 S78.1
  Bottom 0.406: v65.25,13.47 65.25,3.6 S78.1
N$25
  Top 0.406: T8.2 71.56,16.85 71.56,13.2 71.74,13.02 71.74,9.02 70.05,7.33 TVS8.A 70.14,7.16 70.32,6.98 S78.2 | S78.2
N$26
  Top 0.178: R5.2 49.52,36.94 49.52,35.87 58.23,27.16 58.23,26.98 T5.3
N$27
  Top 0.178: R6.2 52.54,36.94 53.87,36.94 56.27,34.54 57.87,34.54 60.54,31.87 60.54,31.69 63.12,29.11 64.01,29.11 65.25,27.87 65.25,26.98 T6.3
N$28  (via drill 0.3)
  Top 0.178: v56.72,36.58 56.36,36.94 55.56,36.94 R7.2 | v66.5,28.85 70.41,28.85 72.28,26.98 T7.3
  Bottom 0.178: v56.72,36.58 62.05,36.58 62.76,37.29 63.3,37.29 66.5,34.09 v66.5,28.85
N$29
  Top 0.178: R8.2 58.59,36.94 61.61,36.94 64.01,34.54 65.25,34.54 69.96,29.83 72.1,29.83 73.97,27.96 73.97,17.02 73.88,16.94 T8.3
N$30
  Top 0.178: 1307.2 60.01,60.94 61.52,60.94 62.32,61.74 X.1
N$31
  Top 0.178: RR.1 84.99,11.96 84.99,8.22 84.81,8.04 TVSR.C 84.81,7.96 84.81,3.78 84.99,3.6 RAIN.1
N$32
  Top 0.178: 66.05,66.01 RB.2 66.05,66.1 66.05,67.61 66.85,68.41 66.85,70.1 66.05,70.9 Q1.1 65.96,70.99 64.01,70.99 RQ.1
N$33
  Top 0.178: RD.1 46.05,51.96 46.23,51.96 48.63,49.56 48.63,48.49 74HC595.14
N$34
  Top 0.178: RC.1 55.92,51.96 55.47,51.96 52.54,49.03 52.54,48.49 74HC595.11
N$35
  Top 0.178: RT.1 53.43,51.96 53.43,51.16 51.3,49.03 51.3,48.49 74HC595.12
N$36
  Top 0.178: 1307.3 60.01,62.19 61.43,62.19 61.96,62.72 62.76,62.72 64.99,60.5 64.99,54.18 BAT.P$2
N$37
  Bottom 0.178: U$2.12 31,16.95 31,18 32.5,19.5 32.5,19.9 33.1,20.5 34.55,20.5 35.8,21.75 36.45,21.75 37.25,22.55 38.7,22.55 40.05,23.9 40.05,73.3 38.15,75.2 36.75,75.2 35.95,76 34.5,76 33.6,76.9 32.9,76.9 32.1,77.7 30.65,77.7 29.6,78.75 29.6,80.25 28.6,81.25 JP4.12
N$38
  Bottom 0.178: U$2.14 33.55,16.95 33.55,18.05 35,19.5 35,19.85 36.1,20.95 36.75,20.95 37.55,21.75 39,21.75 40.85,23.6 40.85,75.05 40.7,75.2 39.25,75.2 38.45,76 37.05,76 36.25,76.8 34.8,76.8 33.9,77.7 33.2,77.7 32.15,78.75 32.15,80.25 31.15,81.25 JP4.14
N$39
  Bottom 0.178: U$2.16 36.1,16.95 36.1,18.05 37.45,19.4 37.45,20.55 37.85,20.95 39.3,20.95 40.1,21.75 41.55,21.75 41.65,21.85 41.65,75.35 41,76 39.55,76 38.75,76.8 37.35,76.8 36.55,77.6 35.1,77.6 34.7,78 34.7,80.2 33.65,81.25 JP4.16
N$40
  Top 0.178: 49.96,52.05 50.94,52.05 RO.1 | 49.96,52.05 48.54,52.05 ROE.1 | 49.96,52.05 49.96,48.49 74HC595.13
N$41
  Bottom 0.178: U$2.23 46.25,19.5 47.2,20.45 47.2,20.7 47.85,21.35 49.3,21.35 50.1,22.15 51.55,22.15 52.35,22.95 53.8,22.95 54.6,23.75 56.05,23.75 56.85,24.55 58.25,24.55 59.05,25.35 60.5,25.35 60.95,25.8 62.4,25.8 63.2,26.6 66.85,26.6 67.55,27.3 67.55,58.75 63.5,62.8 63.5,63.45 63,63.95 63,70.65 62.05,71.6 60.8,71.6 60,72.4 58.55,72.4 57.75,73.2 56.3,73.2 55.5,74 54.05,74 53.25,74.8 51.8,74.8 51,75.6 49.6,75.6 48.8,76.4 47.35,76.4 46.55,77.2 45.1,77.2 44.45,77.85 44.45,78.1 43.85,78.7 JP4.23
N$42
  Bottom 0.178: U$2.25 48.8,19.5 49.75,20.45 49.75,20.7 50.4,21.35 51.85,21.35 52.65,22.15 54.1,22.15 54.9,22.95 56.35,22.95 57.15,23.75 58.55,23.75 59.35,24.55 60.8,24.55 61.25,25 62.7,25 63.5,25.8 67.15,25.8 68.35,27 68.35,59.05 64.3,63.1 64.3,63.75 63.8,64.25 63.8,70.95 62.35,72.4 61.1,72.4 60.3,73.2 58.85,73.2 58.05,74 56.6,74 55.8,74.8 54.35,74.8 53.55,75.6 52.1,75.6 51.3,76.4 49.9,76.4 49.1,77.2 47.65,77.2 47,77.85 47,78.05 46.35,78.7 JP4.25
N$43
  Bottom 0.178: U$2.27 51.35,19.5 52.3,20.45 52.3,20.7 52.95,21.35 54.4,21.35 55.2,22.15 56.65,22.15 57.45,22.95 58.85,22.95 59.65,23.75 61.1,23.75 61.55,24.2 63,24.2 63.8,25 67.45,25 69.15,26.7 69.15,59.35 65.1,63.4 65.1,64.05 64.6,64.55 64.6,71.25 62.65,73.2 61.4,73.2 60.6,74 59.15,74 58.35,74.8 56.9,74.8 56.1,75.6 54.65,75.6 53.85,76.4 52.4,76.4 51.6,77.2 50.2,77.2 49.55,77.85 49.55,78.05 48.9,78.7 JP4.27
N$44
  Bottom 0.178: U$2.29 53.85,19.5 54.85,20.5 54.85,20.7 55.5,21.35 56.95,21.35 57.75,22.15 59.15,22.15 59.95,22.95 61.4,22.95 61.85,23.4 63.3,23.4 64.1,24.2 67.75,24.2 69.95,26.4 69.95,59.65 65.9,63.7 65.9,64.35 65.4,64.85 65.4,71.55 62.95,74 61.7,74 60.9,74.8 59.45,74.8 58.65,75.6 57.2,75.6 56.4,76.4 54.95,76.4 54.15,77.2 52.7,77.2 52.1,77.8 52.1,78.05 51.45,78.7 JP4.29
N$45
  Bottom 0.178: U$2.39 66.55,19.5 68.55,19.5 73.95,24.9 73.95,68.5 64.8,77.65 64.8,78.05 64.15,78.7 JP4.39
N$46
  Bottom 0.178: U$2.37 64.05,19.5 64.65,20.1 64.65,20.35 65.3,21 68.95,21 73.15,25.2 73.15,60.85 69.1,64.9 69.1,65.55 68.6,66.05 68.6,72.75 64.15,77.2 62.9,77.2 62.25,77.85 62.25,78.05 61.6,78.7 JP4.37
N$47
  Bottom 0.178: U$2.17 38.65,19.5 39.6,20.45 39.6,20.7 40.25,21.35 41.7,21.35 42.05,21.7 42.05,75.5 41.15,76.4 39.7,76.4 38.9,77.2 37.5,77.2 36.85,77.85 36.85,78.05 36.2,78.7 JP4.17
N$48
  Bottom 0.178: U$2.19 41.15,19.5 42.15,20.5 42.15,20.7 42.85,21.4 42.85,75.8 41.45,77.2 40,77.2 39.4,77.8 39.4,78.05 38.75,78.7 JP4.19
N$49
  Bottom 0.178: JP4.21 41.9,78.1 41.9,77.85 43.65,76.1 43.65,19.5 U$2.21
N$50
  Bottom 0.178: U$2.35 61.5,19.5 62.45,20.45 62.45,20.7 62.75,21 64.2,21 65,21.8 68.65,21.8 72.35,25.5 72.35,60.55 68.3,64.6 68.3,65.25 67.8,65.75 67.8,72.45 63.85,76.4 62.6,76.4 61.8,77.2 60.35,77.2 59.7,77.85 59.7,78.05 59.05,78.7 JP4.35
N$51
  Bottom 0.178: U$2.33 58.95,19.5 59.9,20.45 59.9,20.7 60.55,21.35 62,21.35 62.45,21.8 63.9,21.8 64.7,22.6 68.35,22.6 71.55,25.8 71.55,60.25 67.5,64.3 67.5,64.95 67,65.45 67,72.15 63.55,75.6 62.3,75.6 61.5,76.4 60.05,76.4 59.25,77.2 57.8,77.2 57.15,77.85 57.15,78.1 56.55,78.7 JP4.33
N$52
  Bottom 0.178: JP4.31 54.6,78.1 54.6,77.85 55.25,77.2 56.7,77.2 57.5,76.4 58.95,76.4 59.75,75.6 61.2,75.6 62,74.8 63.25,74.8 66.2,71.85 66.2,65.15 66.7,64.65 66.7,64 70.75,59.95 70.75,26.1 68.05,23.4 64.4,23.4 63.6,22.6 62.15,22.6 61.7,22.15 60.25,22.15 59.45,21.35 58.05,21.35 57.4,20.7 57.4,20.5 56.4,19.5 U$2.31
N$53
  Bottom 0.178: U$2.34 58.95,16.95 58.95,18.05 60.3,19.4 60.3,20.55 60.7,20.95 62.15,20.95 62.6,21.4 64.05,21.4 64.85,22.2 68.5,22.2 71.95,25.65 71.95,60.4 67.9,64.45 67.9,65.1 67.4,65.6 67.4,72.3 63.7,76 62.45,76 61.65,76.8 60.2,76.8 59.4,77.6 57.95,77.6 57.55,78 57.55,80.25 56.55,81.25 JP4.34
N$54
  Bottom 0.178: U$2.36 61.5,16.95 61.5,18.05 62.85,19.4 62.85,20.55 62.9,20.6 64.35,20.6 65.15,21.4 68.8,21.4 72.75,25.35 72.75,60.7 68.7,64.75 68.7,65.4 68.2,65.9 68.2,72.6 64,76.8 62.75,76.8 61.95,77.6 60.5,77.6 60.1,78 60.1,80.2 59.05,81.25 JP4.36
N$55
  Bottom 0.178: JP4.38 61.6,81.25 62.65,80.2 62.65,78 63.05,77.6 64.3,77.6 69,72.9 69,66.2 69.5,65.7 69.5,65.05 73.55,61 73.55,25.05 69.1,20.6 65.45,20.6 65.05,20.2 65.05,17.95 64.05,16.95 U$2.38
N$56
  Bottom 0.178: JP4.40 65.2,80.2 65.2,77.8 74.35,68.65 74.35,24.75 66.55,16.95 U$2.40
N$59
  Bottom 0.178: U$2.18 38.65,16.95 38.65,18.05 40,19.4 40,20.55 40.4,20.95 41.85,20.95 42.45,21.55 42.45,75.65 41.3,76.8 39.85,76.8 39.05,77.6 37.65,77.6 37.25,78 37.25,80.2 36.2,81.25 JP4.18
N$60
  Bottom 0.178: JP4.20 39.8,80.2 39.8,77.95 40.15,77.6 41.6,77.6 43.25,75.95 43.25,21.25 42.55,20.55 42.55,19.4 41.15,18 41.15,16.95 U$2.20
N$61
  Bottom 0.178: U$2.22 43.7,16.95 43.7,18 45.1,19.4 45.1,20.55 45.5,20.95 46.9,20.95 47.7,21.75 49.15,21.75 49.95,22.55 51.4,22.55 52.2,23.35 53.65,23.35 54.45,24.15 55.9,24.15 56.7,24.95 58.1,24.95 58.9,25.75 60.35,25.75 60.8,26.2 62.25,26.2 63.05,27 66.7,27 67.15,27.45 67.15,58.6 63.1,62.65 63.1,63.3 62.6,63.8 62.6,70.5 61.9,71.2 60.65,71.2 59.85,72 58.4,72 57.6,72.8 56.15,72.8 55.35,73.6 53.9,73.6 53.1,74.4 51.65,74.4 50.85,75.2 49.45,75.2 48.65,76 47.2,76 46.4,76.8 44.95,76.8 44.15,77.6 42.7,77.6 42.3,78 42.3,80.25 41.3,81.25 JP4.22
N$62
  Bottom 0.178: U$2.24 46.25,16.95 46.25,18.05 47.6,19.4 47.6,20.55 48,20.95 49.45,20.95 50.25,21.75 51.7,21.75 52.5,22.55 53.95,22.55 54.75,23.35 56.2,23.35 57,24.15 58.4,24.15 59.2,24.95 60.65,24.95 61.1,25.4 62.55,25.4 63.35,26.2 67,26.2 67.95,27.15 67.95,58.9 63.9,62.95 63.9,63.6 63.4,64.1 63.4,70.8 62.2,72 60.95,72 60.15,72.8 58.7,72.8 57.9,73.6 56.45,73.6 55.65,74.4 54.2,74.4 53.4,75.2 51.95,75.2 51.15,76 49.75,76 48.95,76.8 47.5,76.8 46.7,77.6 45.25,77.6 44.85,78 44.85,80.25 43.85,81.25 JP4.24
N$63
  Bottom 0.178: U$2.26 48.8,16.95 48.8,18.05 50.15,19.4 50.15,20.55 50.55,20.95 52,20.95 52.8,21.75 54.25,21.75 55.05,22.55 56.5,22.55 57.3,23.35 58.7,23.35 59.5,24.15 60.95,24.15 61.4,24.6 62.85,24.6 63.65,25.4 67.3,25.4 68.75,26.85 68.75,59.2 64.7,63.25 64.7,63.9 64.2,64.4 64.2,71.1 62.5,72.8 61.25,72.8 60.45,73.6 59,73.6 58.2,74.4 56.75,74.4 55.95,75.2 54.5,75.2 53.7,76 52.25,76 51.45,76.8 50.05,76.8 49.25,77.6 47.8,77.6 47.4,78 47.4,80.2 46.35,81.25 JP4.26
N$64
  Bottom 0.178: U$2.28 51.35,16.95 51.35,18.05 52.7,19.4 52.7,20.55 53.1,20.95 54.55,20.95 55.35,21.75 56.8,21.75 57.6,22.55 59,22.55 59.8,23.35 61.25,23.35 61.7,23.8 63.15,23.8 63.95,24.6 67.6,24.6 69.55,26.55 69.55,59.5 65.5,63.55 65.5,64.2 65,64.7 65,71.4 62.8,73.6 61.55,73.6 60.75,74.4 59.3,74.4 58.5,75.2 57.05,75.2 56.25,76 54.8,76 54,76.8 52.55,76.8 51.75,77.6 50.35,77.6 49.95,78 49.95,80.2 48.9,81.25 JP4.28
N$65
  Bottom 0.178: JP4.30 52.5,80.2 52.5,77.95 52.85,77.6 54.3,77.6 55.1,76.8 56.55,76.8 57.35,76 58.8,76 59.6,75.2 61.05,75.2 61.85,74.4 63.1,74.4 65.8,71.7 65.8,65 66.3,64.5 66.3,63.85 70.35,59.8 70.35,26.25 67.9,23.8 64.25,23.8 63.45,23 62,23 61.55,22.55 60.1,22.55 59.3,21.75 57.9,21.75 57.1,20.95 55.65,20.95 55.25,20.55 55.25,19.4 53.85,18 53.85,16.95 U$2.30
N$66
  Bottom 0.178: U$2.32 56.4,16.95 56.4,18 57.8,19.4 57.8,20.55 58.2,20.95 59.6,20.95 60.4,21.75 61.85,21.75 62.3,22.2 63.75,22.2 64.55,23 68.2,23 71.15,25.95 71.15,60.1 67.1,64.15 67.1,64.8 66.6,65.3 66.6,72 63.4,75.2 62.15,75.2 61.35,76 59.9,76 59.1,76.8 57.65,76.8 56.85,77.6 55.4,77.6 55,78 55,80.25 54,81.25 JP4.32
N$77
  Top 0.406: Q1.3 68.1,72.05 66.32,73.83 66.32,77.39 67.92,78.99 DF.A 68.19,79.08 71.21,79.08 73.08,80.94 73.79,80.94 RELAY.9
NC
  Top 0.508: RELAY.1 71.39,73.3 72.01,73.3 73.25,72.05 88.1,72.05 88.99,72.94 JC.1
NO
  Bottom 0.508: RELAY.10 71.39,80.94 72.01,80.94 73.34,79.61 87.66,79.61 88.99,80.94 JO.1
QH*
  Top 0.178: 74HC595.9 55.03,48.41 55.03,47.87 50.58,43.43 50.58,39.25 52.01,37.83 56.36,37.83 57.52,36.67 57.52,35.43 60.9,32.05 60.9,31.87 63.3,29.47 71.92,29.47 73.61,27.78 73.61,18.89 72.9,18.18 72.9,15.69 73.61,14.98 88.19,14.98 90.68,12.49 90.68,11.16 94.59,7.25 95.57,7.25 EXTOUT1.7
RL
  Top 0.178: RB.1 63.92,66.01 52.45,66.01 39.83,78.63 39.83,79.17 38.76,80.23 38.23,80.23 37.25,81.21 37.25,81.74 36.63,82.37 27.11,82.37 26.05,81.3 JP4.10
  Bottom 0.178: JP4.10 27.15,80.15 27.15,78.65 28.1,77.7 29.55,77.7 30.35,76.9 31.8,76.9 32.6,76.1 33.3,76.1 34.2,75.2 35.65,75.2 36.45,74.4 37.85,74.4 39.25,73 39.25,24.2 38.4,23.35 36.95,23.35 36.15,22.55 35.5,22.55 34.25,21.3 32.8,21.3 32,20.5 30.55,20.5 29.95,19.9 29.95,19.4 28.45,17.9 28.45,16.95 U$2.10
RS  (via drill 0.3)
  Top 0.178: RP.1 89.43,12.05 87.03,12.05 RR.2 86.94,11.96 v85.61,10.62 | v28.27,15.25 27.56,15.25 25.96,16.85 U$2.8
  Bottom 0.178: U$2.8 25.95,16.95 25.95,18.05 27.3,19.4 27.3,19.9 28,20.6 30.1,20.6 30.4,20.9 31.85,20.9 32.65,21.7 34.1,21.7 35.35,22.95 36,22.95 36.8,23.75 38.25,23.75 38.85,24.35 38.85,72.85 37.7,74 36.3,74 35.5,74.8 34.05,74.8 33.15,75.7 32.45,75.7 31.65,76.5 30.2,76.5 29.4,77.3 27.95,77.3 27.65,77.6 25.55,77.6 24.55,78.6 24.55,80.2 23.5,81.25 JP4.8 | v85.61,10.62 81.88,10.62 78.77,7.51 72.19,7.51 64.81,14.89 28.63,14.89 v28.27,15.25
SCL
  Top 0.178: 1307.6 53.7,62.19 51.92,62.19 43.03,71.08 37.16,71.08 32.18,76.05 32.18,79.17 31.47,79.88 22.05,79.88 20.98,78.81 JP4.5 | PCF8591.10 22.14,38.27 22.67,38.27 23.47,37.47 23.47,19.6 23.38,19.51 U$2.5
  Bottom 0.178: U$2.5 23.4,19.5 24.45,19.5 25.45,20.5 26.8,20.5 27.7,21.4 29.8,21.4 30.1,21.7 31.55,21.7 32.35,22.5 33.8,22.5 35.05,23.75 35.7,23.75 36.5,24.55 37.95,24.55 38.05,24.65 38.05,72.55 37.4,73.2 36,73.2 35.2,74 33.75,74 32.85,74.9 32.15,74.9 31.35,75.7 29.9,75.7 29.1,76.5 27.65,76.5 27.35,76.8 25.25,76.8 24.35,77.7 21.95,77.7 20.95,78.7 JP4.5
SDA  (via drill 0.3)
  Top 0.178: v37.43,71.7 42.94,71.7 51.21,63.43 53.7,63.43 1307.5 | PCF8591.9 22.05,37.03 22.05,20.67 20.89,19.51 U$2.3
  Bottom 0.178: 37.65,71.7 37.65,72.4 37.25,72.8 35.85,72.8 35.05,73.6 33.6,73.6 32.7,74.5 32,74.5 31.2,75.3 29.75,75.3 28.95,76.1 27.5,76.1 27.2,76.4 25.1,76.4 24.2,77.3 21.8,77.3 21.4,77.7 19.45,77.7 18.45,78.7 JP4.3 | 37.65,71.7 37.65,26.25 35.55,24.15 34.9,24.15 33.65,22.9 32.2,22.9 31.4,22.1 29.95,22.1 29.65,21.8 27.55,21.8 26.65,20.9 25.3,20.9 24.9,20.5 22.95,20.5 21.95,19.5 20.85,19.5 U$2.3 | 37.65,71.7 v37.43,71.7
VCC  (via drill 0.3)
  Top 0.178: JP6.5 8.53,36.91 8.53,39.31 JP6.4 | ROE.2 48.54,54.01 48.9,54.01 49.78,54.9 56.81,54.9 56.98,54.72 56.98,51.34 55.47,49.83 54.67,49.83 53.78,48.94 53.78,48.49 74HC595.10 53.7,48.41 53.7,47.87 52.98,47.16 48.27,47.16 48.09,47.34 48.09,49.56 47.83,49.83 47.03,49.83 46.23,49.03 46.23,48.49 74HC595.16 46.14,48.41 45.78,48.05 44.01,48.05 C3.1 43.92,48.05 37.78,48.05 v34.14,51.7 | RP.2 91.57,12.05 93.97,12.05 95.3,13.38 96.01,13.38 97.08,12.31 97.08,8.31 98.15,7.25 EXTOUT1.8 | 23.47,46.01 22.14,46.01 PCF8591.16 | 23.47,46.01 25.43,46.01 C5.1 | 23.47,46.01 23.47,44.23 22.67,43.43 22.14,43.43 PCF8591.14 22.05,43.43 14.67,43.43 14.05,44.05 8.89,44.05 8.53,44.41 JP6.2
  Bottom 0.178: JP6.4 8.53,39.4 8.53,41.89 JP6.3 8.53,41.98 8.53,44.38 JP6.2 8.53,44.47 8.53,46.87 JP6.1 8.53,47.07 16,47.07 22.62,53.7 | 22.62,53.7 22.67,53.74 22.67,62.27 15.91,69.03 15.91,78.72 JP4.1 | v34.14,51.7 24.62,51.7 22.62,53.7 | JP6.5 8.53,36.76 8.53,29.2 18.22,19.51 U$2.1 18.31,19.42 19.47,18.27 19.47,16.4 18.67,15.6 18.67,3.07 19.56,2.18 92.37,2.18 97.17,6.98 98.15,6.98 EXTOUT1.8
VIN  (via drill 0.3)
  Top 0.406: RELAY.2 73.79,73.39 72.28,74.9 68.01,74.9 DF.C 69.08,74.72 69.08,69.3 68.81,69.03 68.81,66.9 66.67,64.76 59.21,64.76 56.45,62.01 56.45,61.47 54.59,59.61 53.96,59.61 1307.8 53.7,59.52 50.85,59.52 C4.1 50.67,59.61 40.27,59.61 v35.65,64.23 | LED.A 2.13,78.01 4.62,80.5 15.11,80.5 15.82,81.21 JP4.2 16,81.3 18.4,81.3 JP4.4 | U$2.4 20.8,16.94 18.31,16.94 U$2.2 | v21.96,54.01 21.96,52.14 F2.2 | D3.C F2.2 | v20.36,50.27 21.96,51.87 F2.2
  Bottom 0.406: 15.82,80.41 15.82,81.21 JP4.2 | 15.82,80.41 14.58,79.17 14.58,69.56 21.96,62.19 v21.96,54.01 | v35.65,64.23 31.11,64.23 17.16,78.19 17.16,79.25 16,80.41 15.82,80.41 | v20.36,50.27 19.56,49.47 19.56,18.98 20.8,17.73 20.8,16.94 U$2.4
VIN_PRE
  Top 0.406: 17.96,53.65 17.96,52.05 F2.1 | 17.96,53.65 17.96,57.83 19.38,59.25 20.18,59.25 LM2596.4 | C2.+ 6.22,67.43 5.51,66.72 5.51,62.01 C0.1 5.42,61.83 1.25,57.65 1.25,55.52 L1.2 1.42,55.43 3.2,53.65 17.96,53.65

### Text on the board
tNames: +5V | NO | 3V3 | CO | OSPi v1.4+ (for RPi B+) | pi.opensprinkler.com | NC | A0 A1 A2 A3 OUT | GND | VCC | S1-8